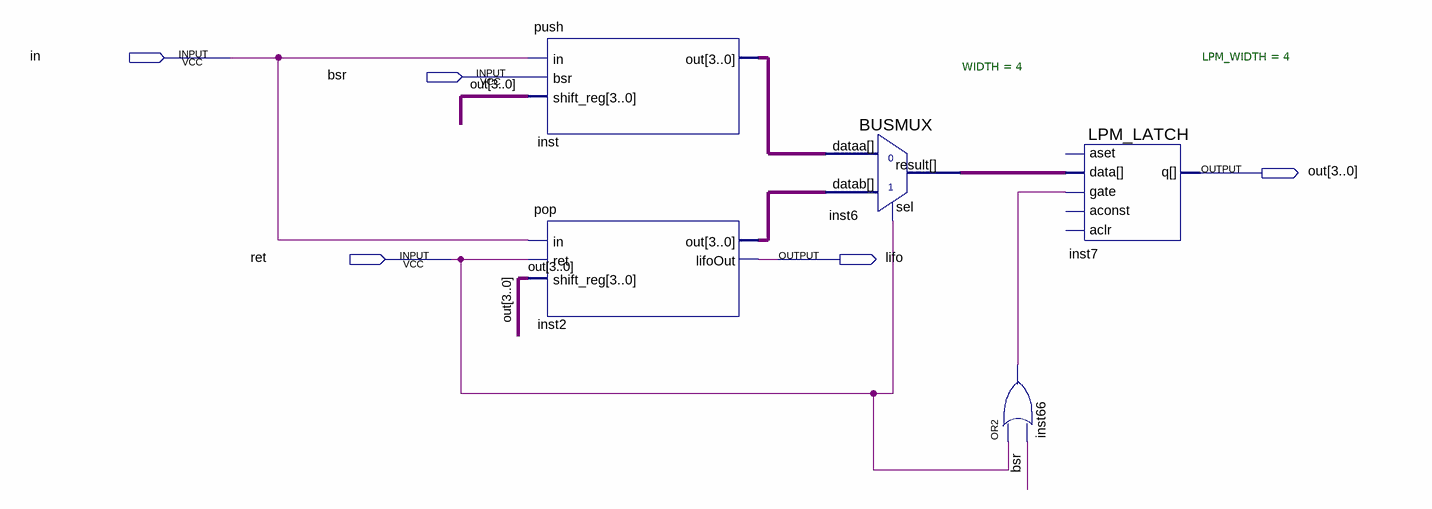
[diagram p0: schematic sheet]
// Quartus schematic push_pop.bdf as structural Verilog: 5 symbols, 5 pins
module push_pop (
  input  in,
  input  bsr,
  input  ret,
  output [3:0] out,
  output lifo
);

  wire inst66_out;
  wire [3:0] inst2_out, inst6_result, inst_out;

  push inst (.in(in), .bsr(bsr), .shift_reg(out), .out(inst_out));
  pop inst2 (.in(in), .ret(ret), .shift_reg(out), .out(inst2_out), .lifoOut(lifo));
  BUSMUX #(.WIDTH(4)) inst6 (.datab(inst2_out), .sel(ret), .dataa(inst_out), .result(inst6_result));
  or inst66 (inst66_out, ret, bsr);
  LPM_LATCH #(.LPM_WIDTH(4)) inst7 (.data(inst6_result), .gate(inst66_out), .q(out));  // open: aset, aconst, aclr
endmodule
